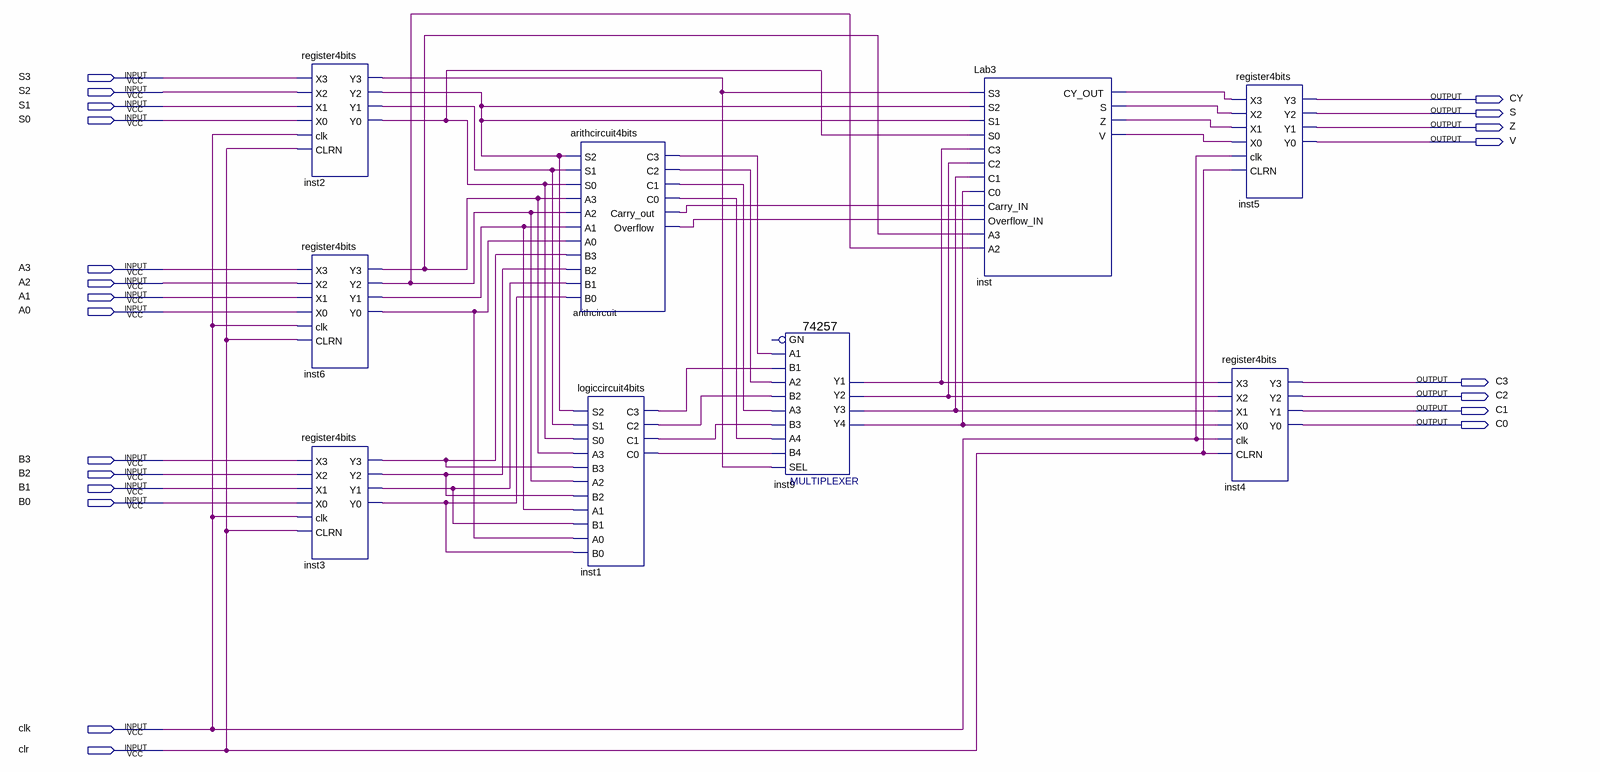
[diagram p0: schematic sheet]
// Quartus schematic lab3top.bdf as structural Verilog: 9 symbols, 22 pins
module lab3top (
  input  S3,
  input  S2,
  input  S1,
  input  S0,
  input  A3,
  input  A2,
  input  A1,
  input  A0,
  input  B3,
  input  B2,
  input  B1,
  input  B0,
  input  clk,
  input  clr,
  output CY,
  output S,
  output Z,
  output V,
  output C3,
  output C2,
  output C1,
  output C0
);

  wire arithcircuit_c0, arithcircuit_c1, arithcircuit_c2, arithcircuit_c3, arithcircuit_carry_out,
       arithcircuit_overflow, inst1_c0, inst1_c1, inst1_c2, inst1_c3, inst2_y0, inst2_y1, inst2_y2, inst2_y3,
       inst3_y0, inst3_y1, inst3_y2, inst3_y3, inst6_y0, inst6_y1, inst6_y2, inst6_y3, inst9_y1, inst9_y2,
       inst9_y3, inst9_y4, inst_cy_out, inst_s, inst_v, inst_z;

  register4bits inst2 (
    .X3(S3), .X2(S2), .X1(S1), .X0(S0), .clk(clk), .CLRN(clr), .Y3(inst2_y3), .Y2(inst2_y2), .Y1(inst2_y1),
    .Y0(inst2_y0));
  register4bits inst6 (
    .X3(A3), .X2(A2), .X1(A1), .X0(A0), .clk(clk), .CLRN(clr), .Y3(inst6_y3), .Y2(inst6_y2), .Y1(inst6_y1),
    .Y0(inst6_y0));
  register4bits inst3 (
    .X3(B3), .X2(B2), .X1(B1), .X0(B0), .clk(clk), .CLRN(clr), .Y3(inst3_y3), .Y2(inst3_y2), .Y1(inst3_y1),
    .Y0(inst3_y0));
  arithcircuit4bits arithcircuit (
    .S2(inst2_y2), .S1(inst2_y1), .S0(inst2_y0), .A3(inst6_y3), .A2(inst6_y2), .A1(inst6_y1), .A0(inst6_y0),
    .B3(inst3_y3), .B2(inst3_y2), .B1(inst3_y1), .B0(inst3_y0), .C3(arithcircuit_c3), .C2(arithcircuit_c2),
    .C1(arithcircuit_c1), .C0(arithcircuit_c0), .Carry_out(arithcircuit_carry_out),
    .Overflow(arithcircuit_overflow));
  logiccircuit4bits inst1 (
    .S2(inst2_y2), .S1(inst2_y1), .S0(inst2_y0), .A3(inst6_y3), .B3(inst3_y3), .A2(inst6_y2), .B2(inst3_y2),
    .A1(inst6_y1), .B1(inst3_y1), .A0(inst6_y0), .B0(inst3_y0), .C3(inst1_c3), .C2(inst1_c2), .C1(inst1_c1),
    .C0(inst1_c0));
  \74257  inst9 (
    .B1(inst1_c3), .A1(arithcircuit_c3), .B3(inst1_c1), .A2(arithcircuit_c2), .B2(inst1_c2),
    .A3(arithcircuit_c1), .A4(arithcircuit_c0), .B4(inst1_c0), .SEL(inst2_y3), .Y2(inst9_y2), .Y3(inst9_y3),
    .Y4(inst9_y4), .Y1(inst9_y1));  // open: GN
  Lab3 inst (
    .S3(inst2_y3), .S2(inst2_y2), .S1(inst2_y2), .S0(inst2_y0), .C3(inst9_y1), .C2(inst9_y2), .C1(inst9_y3),
    .C0(inst9_y4), .Carry_IN(arithcircuit_carry_out), .Overflow_IN(arithcircuit_overflow), .A3(inst6_y3),
    .A2(inst6_y2), .CY_OUT(inst_cy_out), .S(inst_s), .Z(inst_z), .V(inst_v));
  register4bits inst5 (
    .X3(inst_cy_out), .X2(inst_s), .X1(inst_z), .X0(inst_v), .clk(clk), .CLRN(clr), .Y3(CY), .Y2(S), .Y1(Z),
    .Y0(V));
  register4bits inst4 (
    .X3(inst9_y1), .X2(inst9_y2), .X1(inst9_y3), .X0(inst9_y4), .clk(clk), .CLRN(clr), .Y3(C3), .Y2(C2),
    .Y1(C1), .Y0(C0));
endmodule
